# EAGLE design CMoy-Pro-V_B1 (EAGLE 6.4)
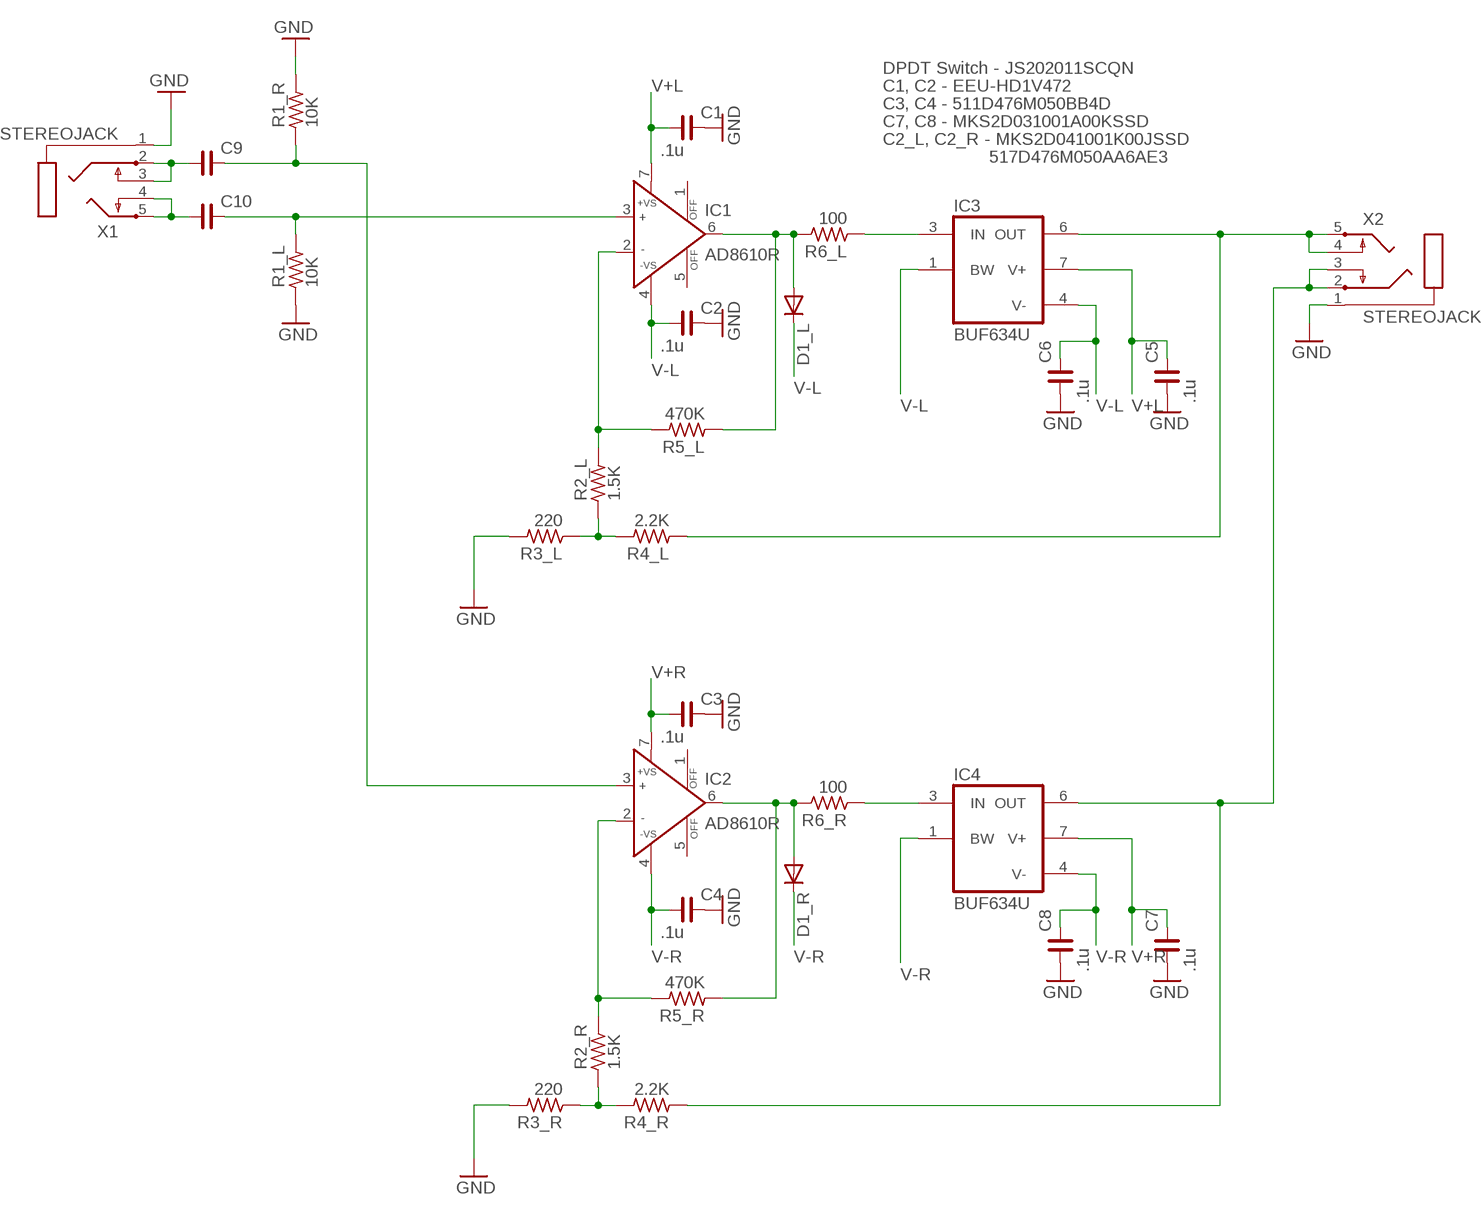
[diagram p0: schematic, sheet 1]

## Parts
C1  .1u  C_0603  [C0603]
C2  .1u  C_0603  [C0603]
C3  .1u  C_0603  [C0603]
C4  .1u  C_0603  [C0603]
C5  .1u  C_0603  [C0603]
C6  .1u  C_0603  [C0603]
C7  .1u  C_0603  [C0603]
C8  .1u  C_0603  [C0603]
C9  C_1210  [C1210]
C10  C_1210  [C1210]
D1_L  DIODE-SOD-123  [SOD-123]
D1_R  DIODE-SOD-123  [SOD-123]
IC1  AD8610R  [SO8]
IC2  AD8610R  [SO8]
IC3  BUF634U  [SO08]
IC4  BUF634U  [SO08]
R1_L  10K  R_0805  [R0805]
R1_R  10K  R_0805  [R0805]
R2_L  1.5K  R_0805  [R0805]
R2_R  1.5K  R_0805  [R0805]
R3_L  220  R_0805  [R0805]
R3_R  220  R_0805  [R0805]
R4_L  2.2K  R_0805  [R0805]
R4_R  2.2K  R_0805  [R0805]
R5_L  470K  R_0805  [R0805]
R5_R  470K  R_0805  [R0805]
R6_L  100  R_0805  [R0805]
R6_R  100  R_0805  [R0805]
X1  STEREOJACK  [STX3100]
X2  STEREOJACK  [STX3100]

## Nets
GND: C1.2 C2.2 C3.2 C4.2 C5.1 C6.1 C7.1 C8.1 R1_L.1 R1_R.2 R3_L.2 R3_R.2 X1.1 X2.1
IN_R: C10.2 IC1.3(IN+) R1_L.2
N$1: C9.2 IC2.3(IN+) R1_R.1
N$2: IC3.6(OUT) R4_L.1 X2.4 X2.5
N$3: IC4.6(OUT) R4_R.1 X2.2 X2.3
N$4: C9.1 X1.2 X1.3
N$5: D1_R.A IC2.6(OUT) R5_R.1 R6_R.2
N$6: IC4.3(IN) R6_R.1
N$7: C10.1 X1.4 X1.5
N$8: D1_L.A IC1.6(OUT) R5_L.1 R6_L.2
N$9: IC3.3(IN) R6_L.1
N$10: IC1.2(IN-) R2_L.2 R5_L.2
N$11: IC2.2(IN-) R2_R.2 R5_R.2
N$12: R2_L.1 R3_L.1 R4_L.2
N$13: R2_R.1 R3_R.1 R4_R.2
V+L: C1.1 C5.2 IC1.7(+VS) IC3.7(V+)
V+R: C3.1 C7.2 IC2.7(+VS) IC4.7(V+)
V-L: C2.1 C6.2 D1_L.C IC1.4(-VS) IC3.1(BW) IC3.4(V-)
V-R: C4.1 C8.2 D1_R.C IC2.4(-VS) IC4.1(BW) IC4.4(V-)
Unconnected: IC1.1(OFF) IC1.5(OFF) IC2.1(OFF) IC2.5(OFF)

## Notes on the sheet
- DPDT Switch - JS202011SCQN
- C1, C2 - EEU-HD1V472
- C3, C4 - 511D476M050BB4D
- C7, C8 - MKS2D031001A00KSSD
- C2_L, C2_R - MKS2D041001K00JSSD
- 517D476M050AA6AE3

## Library data of the parts
C1-C10 = rc-master-smd:C_: NON-POLARIZED CAP
D1_L D1_R = dp_devices:DIODE: Various Diode Packages
IC1 IC2 = analog-devices:AD8610: Precision, Very Low Noise, Low Input Bias Current, Wide Bandwidth JFET Operational Amplifiers Source: http://www.analog.com/static/imported-files/data_sheets/AD8610_8620.pdf; MF: ALTERA CORPORATION; MPN: AD8610BRZ; OC_FARNELL: 8621578; OC_NEWARK: 59K6944
IC3 IC4 = burr-brown-3:BUF634: 250mA High-Speed Buffer
R1_L R1_R R2_L R2_R R3_L R3_R R4_L R4_R R5_L R5_R R6_L R6_R = rc-master-smd:R_: RESISTOR
X1 X2 = adafruit:STEREOJACK: MIC/HEADPHONE JACK Stereo jack with two switches. Kycon STX3100, CUI SJ1-3555NG and/or 4UCon 05544

## Board
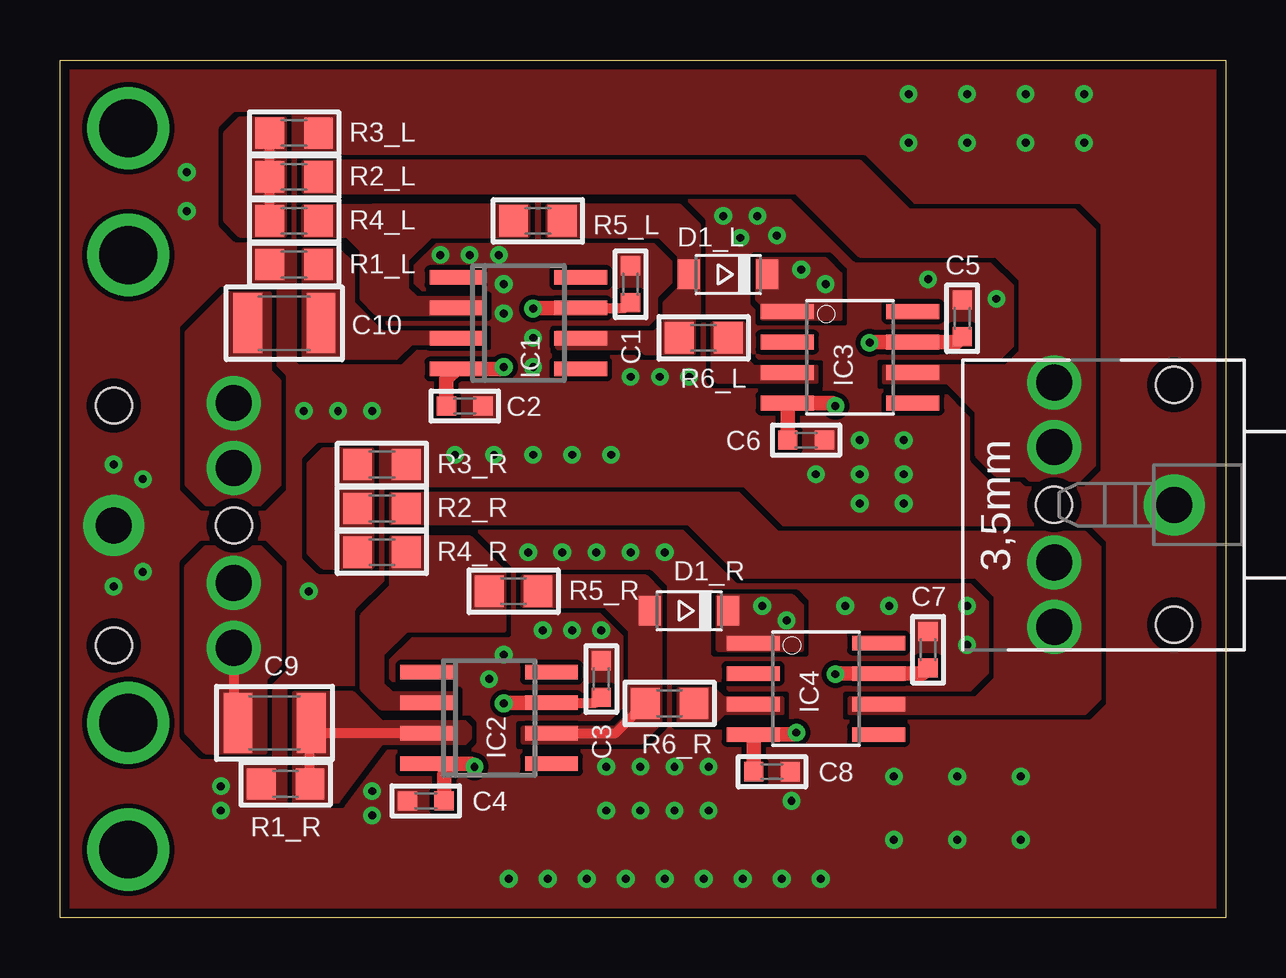
[diagram p1: board, top side]
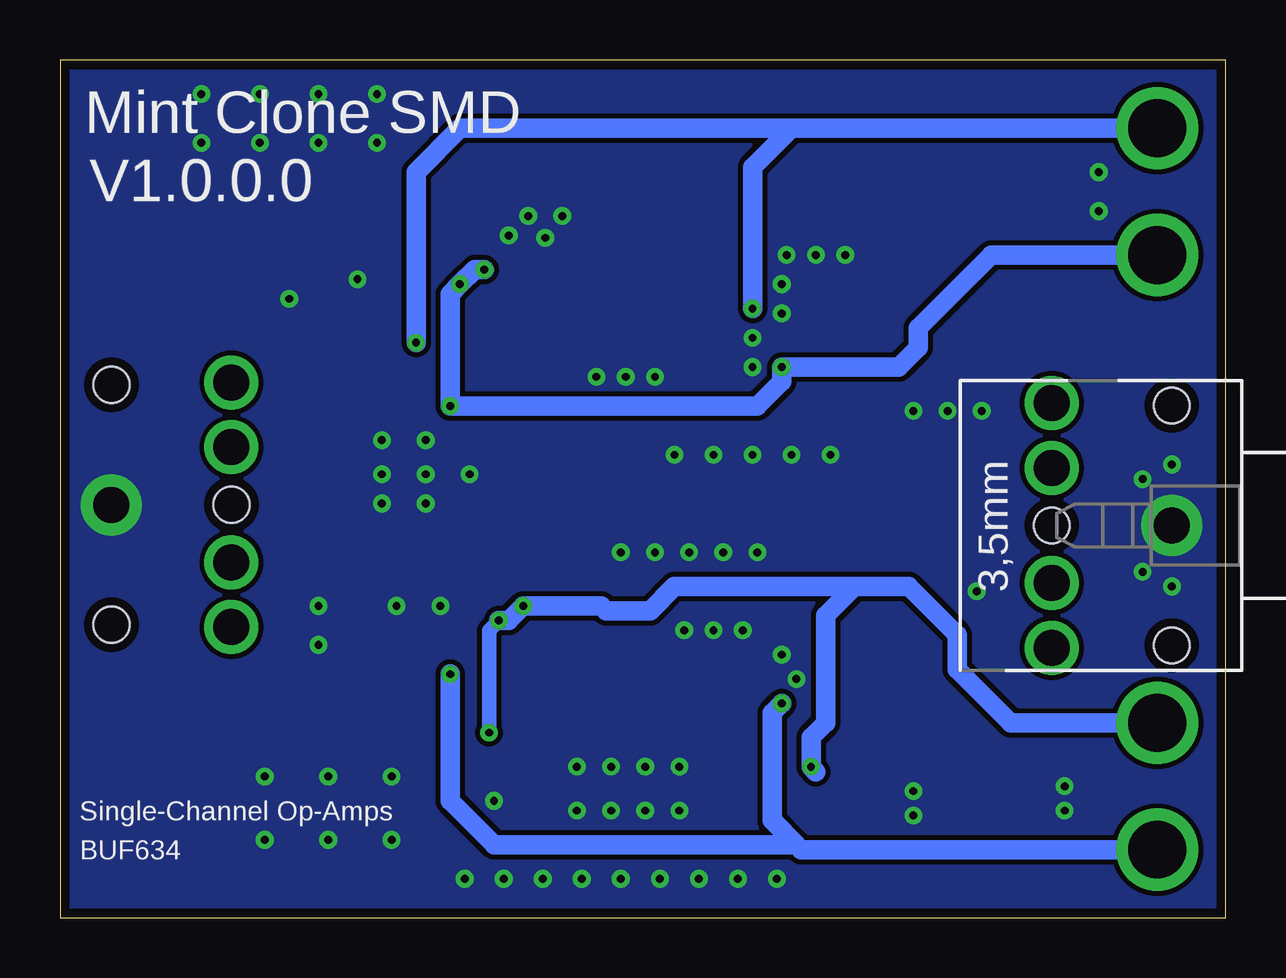
[diagram p2: board, bottom side, seen from below]

Size 48.56 x 35.76 mm. Coordinates in mm from the lower left corner, seen from the top.
Outline: 0,35.76 48.56,35.76 48.56,0 0,0 0,35.76
Copper layers (1*16): Top 0.035mm / dielectric 1.5mm / Bottom 0.035mm
Design rules "default *": minimum track width 10mil, minimum drill 24mil, track to track 8mil, track to pad 8mil, pad to pad 8mil, via to via 8mil, smd to smd 8mil, copper to edge 15mil, drill to drill 8mil, minimum pad ring 10mil, minimum via ring 8mil, stop-mask expansion 4mil, vias tented up to drill 0mil, thermal gap 10mil

### Footprints (pad centres in the part's own frame; a part is rotated, then mirrored left to right if it is on the bottom)
C0603 = smd 0.8 x 0.8: 1 -0.762,0; 2 0.762,0
C1210 = smd 1.2 x 2.5: 1 -1.524,0; 2 1.524,0
SOD-123 = smd 0.91 x 1.22: A 1.635,0; C -1.635,0
SO8 = smd 0.6 x 2.2: 1 -1.905,-2.6; 2 -0.635,-2.6; 3 0.635,-2.6; 4 1.905,-2.6; 5 1.905,2.6; 6 0.635,2.6; 7 -0.635,2.6; 8 -1.905,2.6
SO08 = smd 0.61 x 2.21: 1 -1.905,-2.616; 2 -0.635,-2.616; 3 0.635,-2.616; 4 1.905,-2.616; 5 1.905,2.616; 6 0.635,2.616; 7 -0.635,2.616; 8 -1.905,2.616
R0805 = smd 1.2 x 1.3: 1 -1.016,0; 2 1.016,0
STX3100 = drill 1.5 pad 2.54: 1 2.7,-0.1 | drill 1.5: 2 7.7,5; 3 7.7,2.3; 4 7.7,-2.5; 5 7.7,-5.2 | hole 1.5: 2.7,4.9; 2.7,-5.1; 7.7,-0.1

### Placement (x,y rotation side)
C1  23.77,26.42 90 top
C2  16.87,21.34 0 top
C3  22.56,9.96 90 top
C4  15.24,4.88 180 top
C5  37.59,24.99 270 top
C6  31.09,19.91 180 top
C7  36.17,11.18 270 top
C8  29.67,6.1 180 top
C9  8.94,8.13 0 top
C10  9.35,24.79 0 top
D1_L  27.84,26.82 180 top
D1_R  26.21,12.8 180 top
IC1  19.1,24.79 270 top
IC2  17.88,8.33 270 top
IC3  32.92,23.37 270 top
IC4  31.5,9.55 270 top
R1_L  9.75,27.23 0 top
R1_R  9.4,5.59 180 top
R2_L  9.75,29.06 0 top
R2_R  13.41,15.24 0 top
R3_L  9.75,32.72 0 top
R3_R  13.41,18.9 0 top
R4_L  9.75,30.89 180 top
R4_R  13.41,17.07 180 top
R5_L  19.91,29.06 180 top
R5_R  18.9,13.61 180 top
R6_L  26.82,24.18 180 top
R6_R  25.4,8.94 180 top
X1  -0.46,16.26 180 bottom
X2  49.12,17.12 180 top

### Tracks (layer width: path | path; a pad name or v marks a point on that pad's centre or on a via)
GND  (via drill 0.33)
  other vias: 2.24,18.9 3.45,18.29 3.45,14.43 2.24,13.82 6.71,5.49 6.71,4.47 13,5.28 13,4.27 10.36,13.61 22.76,6.3 30.48,4.88 22.76,4.47 22.56,11.99 24.18,6.3 24.18,4.47 25.6,6.3 25.6,4.47 27.03,6.3 5.28,29.46 21.34,11.99 27.64,29.26 29.06,29.26 28.35,28.35 36.17,26.62 39.01,25.81 10.16,21.13 11.58,21.13 13,21.13 16.46,19.3 18.08,19.3 19.71,19.3 21.34,19.3 22.96,19.3 33.32,19.91 31.5,18.49 34.75,5.89 37.39,5.89 40.03,5.89 34.75,3.25 37.39,3.25 40.03,3.25 5.28,31.09 37.8,13 34.54,13 19.51,15.24 20.93,15.24 22.35,15.24 23.77,15.24 25.2,15.24 17.07,27.64 15.85,27.64 18.29,27.64 18.49,26.42 18.49,25.2 19.71,24.18 19.71,22.96 23.77,22.56 24.99,22.56 26.21,22.56 20.12,11.99 18.49,10.97 17.88,9.96 35.36,34.34 35.36,32.31 37.8,34.34 37.8,32.31 40.23,34.34 40.23,32.31 42.67,34.34 42.67,32.31 35.15,19.91 35.15,18.49 33.32,18.49 33.32,17.27 35.15,17.27 27.03,4.47 32.72,13 37.8,11.38 18.69,1.63 20.32,1.63 21.95,1.63 23.57,1.63 25.2,1.63 26.82,1.63 28.45,1.63 30.07,1.63 31.7,1.63 29.87,28.45
  pour Top (rank 6, no thermals): 0.2,35.56 48.36,35.56 48.36,0.2 0.2,0.2
  pour Bottom (rank 6, no thermals): 0.2,35.56 48.36,35.56 48.36,0.2 0.2,0.2
IN_R
  pour Top (rank 5, no thermals): 11.58,27.84 10.16,27.84 10.16,23.37 14.02,23.37 14.63,23.98 17.68,23.98 17.68,24.38 13.41,24.38 12.19,25.6 12.19,27.23
N$1
  Top 0.406: R1_R.1 10.41,8.08 C9.2 10.9,7.7 IC2.3
  pour Top (rank 5, no thermals): 17.07,7.52 17.07,7.92 16.87,8.13 13.41,8.13 12.19,9.35 9.75,9.35 9.75,4.88 11.58,4.88 13.41,7.32 16.87,7.32
N$2
  pour Top (rank 5, no thermals): 10.16,31.5 10.16,30.28 30.68,30.28 33.32,27.64 39.01,27.64 40.03,26.62 40.03,23.57 39.42,22.96 34.34,22.96 34.34,22.35 36.98,22.35 38.2,21.13 38.2,19.3 39.01,18.49 40.23,18.49 40.44,18.29 42.47,18.29 43.08,18.9 43.08,28.65 42.27,29.46 35.36,29.46 33.32,31.5
N$3
  pour Top (rank 5, no thermals): 13.82,17.68 28.24,17.68 29.87,16.05 42.67,16.05 43.28,15.44 43.28,9.14 42.67,8.53 32.92,8.53 32.92,9.14 38.2,9.14 39.01,9.96 39.01,13.41 38.2,14.22 28.45,14.22 26.21,16.46 13.82,16.46
N$4
  Top 0.406: X1.2 7.24,8.3 C9.1
  pour Top (rank 5, no thermals): 7.32,15.44 8.33,15.44 9.14,14.63 9.14,10.57 8.53,9.96 8.53,6.91 6.1,6.91 5.28,7.72 5.28,14.63 6.1,15.44
N$5
  Top 0.406: IC2.6 23.14,7.7 R6_R.2
  pour Top (rank 5, no thermals): 19.3,14.22 24.38,14.22 24.99,13.61 24.99,8.13 24.18,7.32 19.3,7.32 19.3,7.92 23.16,7.92 23.77,8.53 23.77,11.99 22.76,13 19.3,13
N$6
  pour Top (rank 5, no thermals): 25.81,9.55 27.23,9.55 27.64,9.14 30.07,9.14 30.07,8.53 27.64,8.53 27.23,8.13 25.81,8.13
N$7
  pour Top (rank 5, no thermals): 6.1,17.27 8.33,17.27 9.14,18.08 9.14,22.35 8.74,22.76 8.74,26.01 6.91,26.01 5.28,24.38 5.28,18.08
N$8
  pour Top (rank 5, no thermals): 20.32,28.45 24.99,28.45 25.81,27.64 25.81,26.21 25.2,25.6 25.2,24.79 24.79,24.38 20.73,24.38 20.73,23.77 24.18,23.77 24.38,23.57 26.42,23.57 26.42,24.99 26.62,25.2 26.62,28.85 25.81,29.67 20.32,29.67
N$9
  pour Top (rank 5, no thermals): 31.5,22.35 27.43,22.35 27.23,22.56 27.23,24.79 28.45,24.79 28.45,23.37 28.85,22.96 31.5,22.96
N$10
  pour Top (rank 5, no thermals): 17.68,25.2 13.21,25.2 12.6,25.81 12.6,27.84 11.99,28.45 10.16,28.45 10.16,29.67 13,29.67 14.43,28.24 14.43,26.21 14.83,25.81 17.68,25.81
  pour Top (rank 5, no thermals): 19.51,29.67 13,29.67 13,25.4 13.21,25.2 17.68,25.2 17.68,25.81 14.83,25.81 14.43,26.21 14.43,27.43 15.44,28.45 19.51,28.45
N$11
  pour Top (rank 5, no thermals): 16.46,8.74 13.41,8.74 12.6,9.55 12.6,12.6 13.82,13.82 13.82,15.85 17.07,15.85 18.49,14.43 18.49,11.99 14.43,11.99 13.41,10.97 13.41,9.75 13.82,9.35 16.46,9.35
N$12
  Top 0.406: R2_L.1 R4_L.2 R3_L.1
  pour Top (rank 5, no thermals): 9.35,28.45 7.52,28.45 6.91,29.06 6.91,32.72 7.52,33.32 9.35,33.32
N$13
  pour Top (rank 5, no thermals): 13,17.07 13,19.51 10.97,19.51 10.36,18.9 10.36,15.24 10.97,14.63 13,14.63
V+L  (via drill 0.33, 2.41)
  Top 0.406: IC1.7 23.55,25.43 C1.1
  Top 0.61: v33.73,23.98 33.76,24 IC3.7 37.36,24 C5.2 | IC1.7 19.74,25.43 v19.71,25.4
  Bottom 0.813: v2.84,32.92 18.08,32.92 | 18.08,32.92 19.71,31.29 v19.71,25.4 | v33.73,23.98 33.73,31.09 31.9,32.92 18.08,32.92
V+R  (via drill 0.33, 2.41)
  Top 0.406: IC2.7 22.33,8.97 C3.1
  Top 0.61: v32.31,10.16 32.33,10.19 IC4.7 35.94,10.19 C7.2 | IC2.7 18.52,8.97 v18.49,8.94
  Bottom 0.813: v2.84,2.84 17.68,2.84 17.88,3.05 | 17.88,3.05 18.9,4.06 18.9,8.53 v18.49,8.94 | v32.31,10.16 32.31,4.88 30.48,3.05 17.88,3.05
V-L  (via drill 0.33, 2.41)
  Top 0.61: v32.31,21.34 32.18,21.46 IC3.4 30.33,21.44 C6.2 | v18.49,22.96 18.41,22.89 IC1.4 16.1,22.49 C2.1
  Bottom 0.813: v2.84,27.64 9.75,27.64 12.8,24.59 12.8,23.77 13.61,22.96 v18.49,22.96 18.49,22.35 19.51,21.34 v32.31,21.34 32.31,26.01 v31.9,26.42 31.29,27.03 v30.89,27.03
  pour Top (rank 5, no thermals): 29.06,27.43 29.06,25.81 29.26,25.6 29.26,24.99 32.51,24.99 32.51,26.82 31.9,27.43
V-R  (via drill 0.33, 2.41)
  Top 0.61: IC2.4 16.46,6.43 | 16.46,6.43 17.14,6.43 v17.27,6.3 | v30.68,7.72 30.61,7.65 IC4.4 28.9,7.62 C8.2 | C4.1 16,5.97 16.46,6.43
  Bottom 0.61: v30.68,7.72 30.68,11.99 v30.28,12.4
  Bottom 0.813: 17.07,6.1 v17.27,6.3 17.27,7.52 16.66,8.13 16.66,12.6 15.44,13.82 | 15.44,13.82 22.96,13.82 23.98,12.8 25.81,12.8 26.01,13.01 v29.26,13.01 29.87,12.4 v30.28,12.4 | 15.44,13.82 13.21,13.82 11.18,11.79 11.18,10.36 8.94,8.13 v2.84,8.13
  pour Top (rank 5, no thermals): 27.43,13.41 30.48,13.41 30.89,13 30.89,11.18 27.43,11.18

### Text on the board
bPlace: Mint Clone SMD | V1.0.0.0 | Single-Channel Op-Amps | BUF634